# Altium project ESP32_Seperate.PrjPcb
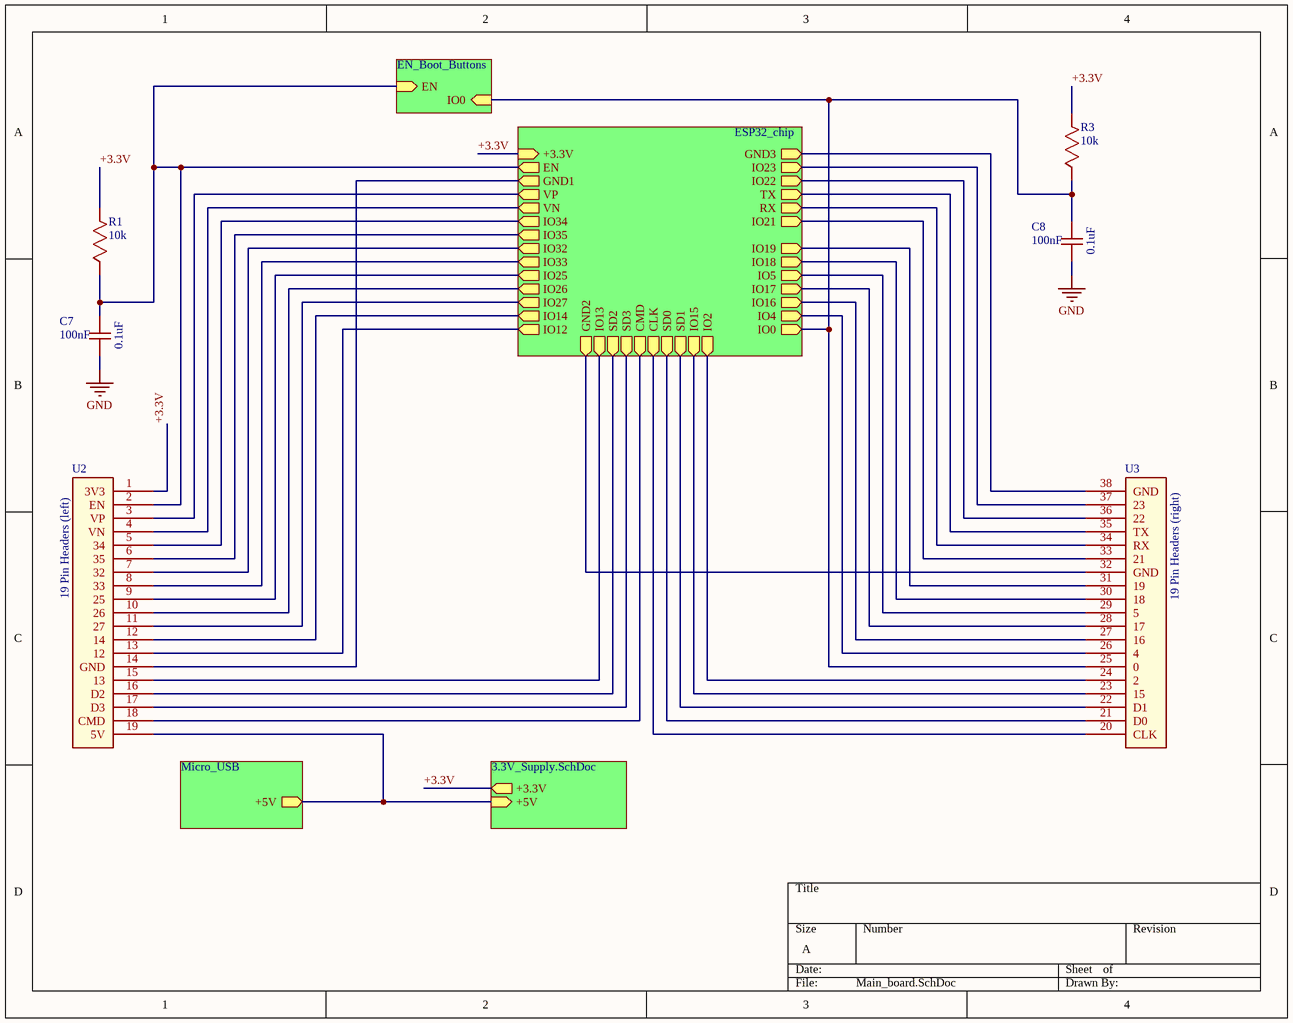
[diagram p0: Main_board.SchDoc]
5 sheets, 19 parts. Net scope: hierarchical (ports join the sheet entries above them; power ports are global).
Board file: ESP32_Seperate.PcbDoc
Sheets:
  Main_board.SchDoc
    ESP32 = ESP32_chip.SchDoc
    Buttons = EN_Boot_Buttons.SchDoc
    Connector = Micro_USB.SchDoc
    Designator = 3.3V_Supply.SchDoc

## Sheet Main_board.SchDoc
size A; SheetNumber: 1; SheetTotal: 5

### Parts
C7  100nF  [CAPC2013X140X45ML15T25]
C8  100nF  [CAPC2013X140X45ML15T25]
R1  10k  [FP-CRGCQ0805-IPC_A]
R3  10k  [FP-CRGCQ0805-IPC_A]
U2  19 Pin Headers (left)  [19 Pin headers]
U3  19 Pin Headers (right)  [19 Pin headers]

### Sub-sheets
Buttons = EN_Boot_Buttons: EN (in), IO0 (in)
Connector = Micro_USB: +5V (out)
Designator = 3.3V_Supply.SchDoc: +5V (in), +3.3V (out)
ESP32 = ESP32_chip: GND1 (out), VP (out), VN (out), IO34 (out), IO35 (out), IO32 (out), IO33 (out), IO25 (out), IO26 (out), IO27 (out), IO14 (out), IO12 (out), GND3 (out), IO23 (out), IO22 (out), TX (out), RX (out), IO21 (out), IO19 (out), IO18 (out), IO5 (out), IO17 (out), IO16 (out), IO4 (out), +3.3V (in), GND2 (out), IO13 (out), SD2 (out), SD3 (out), CMD (out), CLK (out), SD0 (out), SD1 (out), IO15 (out), IO2 (out), IO0 (out), EN (out)

### Nets
GND: C7.1 C8.1
+3.3V: R1.2 R3.2 U2.1(3V3) ; sheet ESP32/+3.3V, sheet Designator/+3.3V
NetB1_2: C7.2 R1.1 U2.2(EN) ; sheet ESP32/EN, sheet Buttons/EN
NetB2_2: C8.2 R3.1 U3.25(0) ; sheet ESP32/IO0, sheet Buttons/IO0
NetC3_1: U2.19(5V) ; sheet Connector/+5V, sheet Designator/+5V
NetU1_1: U2.14(GND) ; sheet ESP32/GND1
NetU1_4: U2.3(VP) ; sheet ESP32/VP
NetU1_5: U2.4(VN) ; sheet ESP32/VN
NetU1_6: U2.5(34) ; sheet ESP32/IO34
NetU1_7: U2.6(35) ; sheet ESP32/IO35
NetU1_8: U2.7(32) ; sheet ESP32/IO32
NetU1_9: U2.8(33) ; sheet ESP32/IO33
NetU1_10: U2.9(25) ; sheet ESP32/IO25
NetU1_11: U2.10(26) ; sheet ESP32/IO26
NetU1_12: U2.11(27) ; sheet ESP32/IO27
NetU1_13: U2.12(14) ; sheet ESP32/IO14
NetU1_14: U2.13(12) ; sheet ESP32/IO12
NetU1_15: U3.32(GND) ; sheet ESP32/GND2
NetU1_16: U2.15(13) ; sheet ESP32/IO13
NetU1_17: U2.16(D2) ; sheet ESP32/SD2
NetU1_18: U2.17(D3) ; sheet ESP32/SD3
NetU1_19: U2.18(CMD) ; sheet ESP32/CMD
NetU1_20: U3.20(CLK) ; sheet ESP32/CLK
NetU1_21: U3.21(D0) ; sheet ESP32/SD0
NetU1_22: U3.22(D1) ; sheet ESP32/SD1
NetU1_23: U3.23(15) ; sheet ESP32/IO15
NetU1_24: U3.24(2) ; sheet ESP32/IO2
NetU1_26: U3.26(4) ; sheet ESP32/IO4
NetU1_27: U3.27(16) ; sheet ESP32/IO16
NetU1_28: U3.28(17) ; sheet ESP32/IO17
NetU1_29: U3.29(5) ; sheet ESP32/IO5
NetU1_30: U3.30(18) ; sheet ESP32/IO18
NetU1_31: U3.31(19) ; sheet ESP32/IO19
NetU1_32: U3.38(GND) ; sheet ESP32/GND3
NetU1_33: U3.33(21) ; sheet ESP32/IO21
NetU1_34: U3.34(RX) ; sheet ESP32/RX
NetU1_35: U3.35(TX) ; sheet ESP32/TX
NetU1_36: U3.36(22) ; sheet ESP32/IO22
NetU1_37: U3.37(23) ; sheet ESP32/IO23

### Notes on the sheet
- (in symbol GCM21BR71E104KA37L) 0.1uF

### Library data of the parts
C7 C8 = GCM21BR71E104KA37L: Ceramic Capacitor, Ceramic, 25V, 10% +Tol, 10% -Tol, X7R, 15% TC, 0.1uF, Surface Mount, 0805; Manufacturer: Murata; Manufacturer Lifecycle Status: NRND; Supplier: DigiKey; Supplier Part Number: 490-14779-1-ND; Manufacturer Part Number: GCM21BR71E104KA37L; RoHS: Compliant; Category: Ceramic Capacitors; Stock: 12316; Pricing: 1=0.35, 10=0.208, 50=0.1528, 100=0.1358, 500=0.10726, 1000=0.09846 (USD); Value: 100nF; Case/Package: 0805; Case Code (Imperial): 0805; Case Code (Metric): 2012; Depth: 1.25mm; Dielectric: X7R; Dielectric Material: Ceramic; Height: 1.25mm; Length: 2mm; Lifecycle Status: NRND; Max Operating Temperature: 125°C; Min Operating Temperature: -55°C; Mounting Technology: Surface Mount; Number of Terminals: 2; Radiation Hardening: No; Ratings: AEC-Q200; REACH SVHC: Yes; Schedule B: 8532240020, 8532240020|8532240020|8532240020|8532240020|8532240020; Termination: SMD/SMT; Tolerance: 10%; Voltage Rating: 25V; Voltage Rating (DC): 25V; Width: 1.25mm; ComponentLink1URL: https://datasheet.octopart.com:443/GCM21BR71E104KA37L-Murata-datasheet-141268656.pdf?src-supplier=Geoflip; ComponentLink1Description: https://datasheet.octopart.com:443/GCM21BR71E104KA37L-Murata-datasheet-141268656.pdf?src-supplier=Geoflip; ComponentLink2URL: https://datasheet.octopart.com:443/GCM21BR71E104KA37L-Murata-datasheet-140660253.pdf?src-supplier=Ciiva; ComponentLink2Description: https://datasheet.octopart.com:443/GCM21BR71E104KA37L-Murata-datasheet-140660253.pdf?src-supplier=Ciiva; ComponentLink3URL: https://datasheet.octopart.com:443/GCM21BR71E104KA37L-Murata-datasheet-138719617.pdf?src-supplier=Ciiva; ComponentLink3Description: https://datasheet.octopart.com:443/GCM21BR71E104KA37L-Murata-datasheet-138719617.pdf?src-supplier=Ciiva; ComponentLink4URL: https://datasheet.octopart.com:443/GCM21BR71E104KA37L-Murata-datasheet-128592896.pdf?src-supplier=X-ON; ComponentLink4Description: https://datasheet.octopart.com:443/GCM21BR71E104KA37L-Murata-datasheet-128592896.pdf?src-supplier=X-ON; ComponentLink5URL: https://datasheet.octopart.com/GCM21BR71E104KA37L-Murata-datasheet-14404970.pdf; ComponentLink5Description: https://datasheet.octopart.com/GCM21BR71E104KA37L-Murata-datasheet-14404970.pdf; ComponentLink6URL: http://sigma.octopart.com:80/reach_statement/Murata-company-16.pdf?src-supplier=Compliance+Statements; ComponentLink6Description: http://sigma.octopart.com:80/reach_statement/Murata-company-16.pdf?src-supplier=Compliance+Statements
R1 R3 = CRGCQ0805J10K: Res Thick Film 0805 10K Ohm 5% 0.125W(1/8W) ±100ppm/C Pad SMD Automotive T/R; Manufacturer: TE Connectivity; Manufacturer Lifecycle Status: ACTIVE; Operating Supply Voltage: 150V; Power Dissipation: 125mW; Value: 10kΩ; Temperature Coefficient: 100ppm/°C; Supplier: DigiKey; Supplier Part Number: A130140CT-ND; Manufacturer Part Number: CRGCQ0805J10K; RoHS: Compliant; Category: Chip SMD Resistors; Stock: 448725; Pricing: 1=0.1, 10=0.031, 25=0.0232, 50=0.0188, 100=0.0153, 250=0.01204, 500=0.01016, 1000=0.00868 (USD); Ambient Temperature Range High: 70°C; China RoHS: Non-Compliant; Composition: Thick Film; Height: 550µm; Lifecycle Status: Production; Max Operating Temperature: 155°C; Min Operating Temperature: -55°C; Mounting Technology: Surface Mount; Number of Terminals: 2; Packaging: Cut Tape; Power Rating: 125mW; REACH SVHC: Yes; Schedule B: 8533210025, 8533210025|8533210025|8533210025|8533210025|8533210025, 8533210045; Tolerance: 5%; Voltage Rating: 150V; Voltage Rating (DC): 150V; Width: 1.25mm; Working Voltage: 150V; ComponentLink1URL: https://datasheet.octopart.com:443/CRGCQ0805J10K-TE-Connectivity-datasheet-114679081.pdf?src-supplier=Master+Electronics; ComponentLink1Description: https://datasheet.octopart.com:443/CRGCQ0805J10K-TE-Connectivity-datasheet-114679081.pdf?src-supplier=Master+Electronics; ComponentLink2URL: https://datasheet.octopart.com:443/2-2176342-5-TE-Connectivity---AMP-datasheet-189108688.pdf?src-supplier=Master+Electronics; ComponentLink2Description: https://datasheet.octopart.com:443/2-2176342-5-TE-Connectivity---AMP-datasheet-189108688.pdf?src-supplier=Master+Electronics; ComponentLink3URL: https://datasheet.octopart.com:443/CRGCQ0805J10K-TE-Connectivity-datasheet-179161841.pdf?src-supplier=IHS; ComponentLink3Description: https://datasheet.octopart.com:443/CRGCQ0805J10K-TE-Connectivity-datasheet-179161841.pdf?src-supplier=IHS; ComponentLink4URL: https://sigma.octopart.com:443/114702769/technical_drawing/TE-Connectivity-CRGCQ0805J10K.pdf?src-supplier=Sager+Electronics; ComponentLink4Description: https://sigma.octopart.com:443/114702769/technical_drawing/TE-Connectivity-CRGCQ0805J10K.pdf?src-supplier=Sager+Electronics

## Sheet ESP32_chip.SchDoc
size A; SheetNumber: 5; SheetTotal: 5
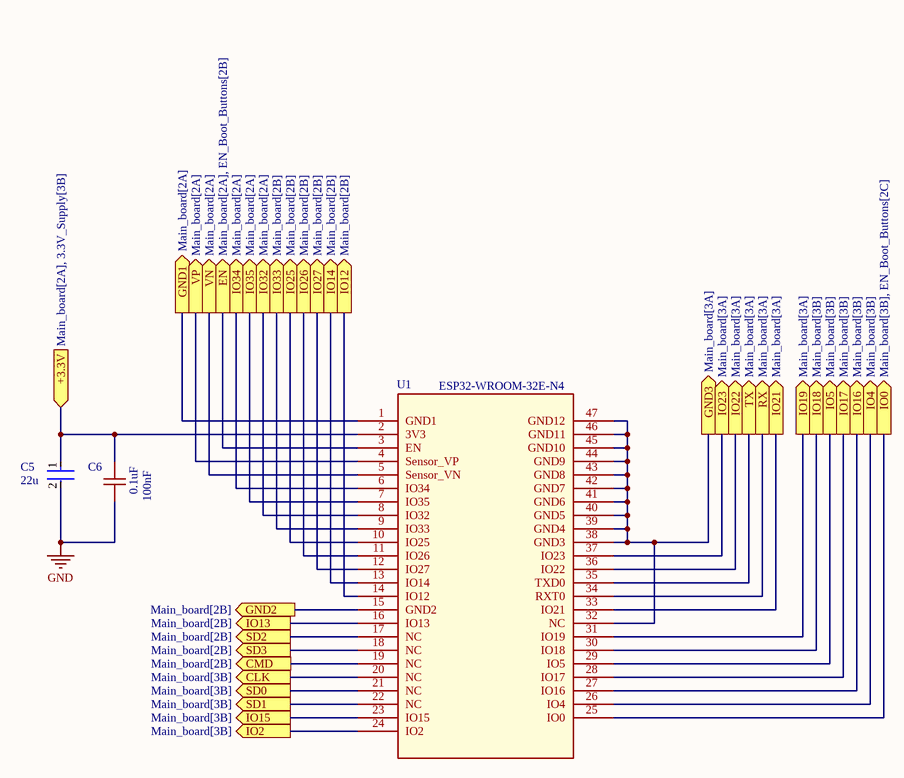
[diagram p1: ESP32_chip.SchDoc]

### Parts
C5  22u  [FP-GRM21B-0_15-IPC_A]
C6  100nF  [CAPC2013X140X45ML15T25]
U1  ESP32-WROOM-32E-N4  [ESP32­WROOM­32E_EXP]

### Ports
+3.3V (in, see Main_board[2A], 3.3V_Supply[3B]), CLK (out, see Main_board[3B]), CMD (out, see Main_board[2B]), EN (out, see Main_board[2A], EN_Boot_Buttons[2B]), GND1 (out, see Main_board[2A]), GND2 (out, see Main_board[2B]), GND3 (out, see Main_board[3A]), IO0 (out, see Main_board[3B], EN_Boot_Buttons[2C]), IO2 (out, see Main_board[3B]), IO4 (out, see Main_board[3B]), IO5 (out, see Main_board[3B]), IO12 (out, see Main_board[2B]), IO13 (out, see Main_board[2B]), IO14 (out, see Main_board[2B]), IO15 (out, see Main_board[3B]), IO16 (out, see Main_board[3B]), IO17 (out, see Main_board[3B]), IO18 (out, see Main_board[3B]), IO19 (out, see Main_board[3A]), IO21 (out, see Main_board[3A]), IO22 (out, see Main_board[3A]), IO23 (out, see Main_board[3A]), IO25 (out, see Main_board[2B]), IO26 (out, see Main_board[2B]), IO27 (out, see Main_board[2B]), IO32 (out, see Main_board[2A]), IO33 (out, see Main_board[2B]), IO34 (out, see Main_board[2A]), IO35 (out, see Main_board[2A]), RX (out, see Main_board[3A]), SD0 (out, see Main_board[3B]), SD1 (out, see Main_board[3B]), SD2 (out, see Main_board[2B]), SD3 (out, see Main_board[2B]), TX (out, see Main_board[3A]), VN (out, see Main_board[2A]), VP (out, see Main_board[2A])

### Nets
GND: C5.2 C6.1
+3.3V: C5.1 C6.2 U1.2(3V3) ; port +3.3V
NetB1_2: U1.3(EN) ; port EN
NetB2_2: U1.25(IO0) ; port IO0
NetU1_1: U1.1(GND1) ; port GND1
NetU1_4: U1.4(Sensor_VP) ; port VP
NetU1_5: U1.5(Sensor_VN) ; port VN
NetU1_6: U1.6(IO34) ; port IO34
NetU1_7: U1.7(IO35) ; port IO35
NetU1_8: U1.8(IO32) ; port IO32
NetU1_9: U1.9(IO33) ; port IO33
NetU1_10: U1.10(IO25) ; port IO25
NetU1_11: U1.11(IO26) ; port IO26
NetU1_12: U1.12(IO27) ; port IO27
NetU1_13: U1.13(IO14) ; port IO14
NetU1_14: U1.14(IO12) ; port IO12
NetU1_15: U1.15(GND2) ; port GND2
NetU1_16: U1.16(IO13) ; port IO13
NetU1_17: U1.17(NC) ; port SD2
NetU1_18: U1.18(NC) ; port SD3
NetU1_19: U1.19(NC) ; port CMD
NetU1_20: U1.20(NC) ; port CLK
NetU1_21: U1.21(NC) ; port SD0
NetU1_22: U1.22(NC) ; port SD1
NetU1_23: U1.23(IO15) ; port IO15
NetU1_24: U1.24(IO2) ; port IO2
NetU1_26: U1.26(IO4) ; port IO4
NetU1_27: U1.27(IO16) ; port IO16
NetU1_28: U1.28(IO17) ; port IO17
NetU1_29: U1.29(IO5) ; port IO5
NetU1_30: U1.30(IO18) ; port IO18
NetU1_31: U1.31(IO19) ; port IO19
NetU1_32: U1.32(NC) U1.38(GND3) U1.39(GND4) U1.40(GND5) U1.41(GND6) U1.42(GND7) U1.43(GND8) U1.44(GND9) U1.45(GND10) U1.46(GND11) U1.47(GND12) ; port GND3
NetU1_33: U1.33(IO21) ; port IO21
NetU1_34: U1.34(RXT0) ; port RX
NetU1_35: U1.35(TXD0) ; port TX
NetU1_36: U1.36(IO22) ; port IO22
NetU1_37: U1.37(IO23) ; port IO23

### Notes on the sheet
- (in symbol GCM21BR71E104KA37L) 0.1uF

### Library data of the parts
C5 = GRM21BR61A226ME51L: 0805 22 uF 10 V ±20% Tolerance X5R SMT Multilayer Ceramic Capacitor; Manufacturer: Murata; Manufacturer Lifecycle Status: IN PRODUCTION; Value: 22µF; Voltage Rating: 10V; Supplier: DigiKey; Supplier Part Number: 490-10511-1-ND; Manufacturer Part Number: GRM21BR61A226ME51L; RoHS: Compliant; Category: Ceramic Capacitors; Stock: 246273; Pricing: 1=0.19, 10=0.111, 50=0.0788, 100=0.069, 500=0.0526, 1000=0.04756 (USD); Case/Package: 0805; Case Code (Imperial): 0805; Case Code (Metric): 2012; Depth: 1.25mm; Dielectric: X5R; Dielectric Material: Ceramic; Height: 1.25mm; Lead Free: Lead Free; Length: 2mm; Lifecycle Status: Production; Material: Ceramic; Max Operating Temperature: 85°C; Min Operating Temperature: -55°C; Mounting Technology: Surface Mount; Number of Terminals: 2; Packaging: Cut Tape; Radiation Hardening: No; REACH SVHC: Yes; Schedule B: 8532240020, 8532240020|8532240020, 8532240020|8532240020|8532240020, 8532240020|8532240020|8532240020|8532240020; Termination: SMD/SMT; Thickness: 1.25mm; Tolerance: 20%; Voltage Rating (DC): 10V; Weight: 9.49709mg; Width: 1.25mm; ComponentLink1URL: https://datasheet.octopart.com:443/GRM21BR61A226ME51L-Murata-datasheet-46741949.pdf?src-supplier=element14+APAC; ComponentLink1Description: https://datasheet.octopart.com:443/GRM21BR61A226ME51L-Murata-datasheet-46741949.pdf?src-supplier=element14+APAC; ComponentLink2URL: https://datasheet.octopart.com:443/GRM21BR61A226ME51L-Murata-datasheet-141278167.pdf?src-supplier=Geoflip; ComponentLink2Description: https://datasheet.octopart.com:443/GRM21BR61A226ME51L-Murata-datasheet-141278167.pdf?src-supplier=Geoflip; ComponentLink3URL: https://datasheet.octopart.com:443/GRM21BR61A226ME51L-Murata-datasheet-165579666.pdf?src-supplier=TME; ComponentLink3Description: https://datasheet.octopart.com:443/GRM21BR61A226ME51L-Murata-datasheet-165579666.pdf?src-supplier=TME; ComponentLink4URL: https://datasheet.octopart.com:443/GRM21BR61A226ME51L-Murata-datasheet-81455648.pdf?src-supplier=TME; ComponentLink4Description: https://datasheet.octopart.com:443/GRM21BR61A226ME51L-Murata-datasheet-81455648.pdf?src-supplier=TME; ComponentLink5URL: https://datasheet.octopart.com:443/GRM21BR61A226ME51L-Murata-datasheet-140707522.pdf?src-supplier=Ciiva; ComponentLink5Description: https://datasheet.octopart.com:443/GRM21BR61A226ME51L-Murata-datasheet-140707522.pdf?src-supplier=Ciiva; ComponentLink6URL: https://datasheet.octopart.com:443/GRM21BR61A226ME51L-Murata-datasheet-138744834.pdf?src-supplier=Ciiva; ComponentLink6Description: https://datasheet.octopart.com:443/GRM21BR61A226ME51L-Murata-datasheet-138744834.pdf?src-supplier=Ciiva; ComponentLink7URL: https://datasheet.octopart.com:443/GRM21BR61A226ME51L-Murata-datasheet-22122223.pdf?src-supplier=Future+Electronics; ComponentLink7Description: https://datasheet.octopart.com:443/GRM21BR61A226ME51L-Murata-datasheet-22122223.pdf?src-supplier=Future+Electronics; ComponentLink8URL: https://datasheet.octopart.com/GRM21BR61A226ME51L-Murata-datasheet-12515295.pdf; ComponentLink8Description: https://datasheet.octopart.com/GRM21BR61A226ME51L-Murata-datasheet-12515295.pdf; ComponentLink9URL: https://datasheet.octopart.com/GRM21BR61A226ME51L-Murata-datasheet-12510076.pdf; ComponentLink9Description: https://datasheet.octopart.com/GRM21BR61A226ME51L-Murata-datasheet-12510076.pdf; ComponentLink10URL: https://datasheet.octopart.com/GRM21BR61A226ME51L-Murata-datasheet-11978611.pdf; ComponentLink10Description: https://datasheet.octopart.com/GRM21BR61A226ME51L-Murata-datasheet-11978611.pdf; ComponentLink11URL: https://datasheet.octopart.com/GRM21BR61A226ME51L-Murata-datasheet-10025737.pdf; ComponentLink11Description: https://datasheet.octopart.com/GRM21BR61A226ME51L-Murata-datasheet-10025737.pdf; ComponentLink12URL: https://datasheet.octopart.com/GRM21BR61A226ME51L-Murata-datasheet-8819587.pdf; ComponentLink12Description: https://datasheet.octopart.com/GRM21BR61A226ME51L-Murata-datasheet-8819587.pdf; ComponentLink13URL: https://datasheet.octopart.com/GRM21BR61A226ME51L-Murata-datasheet-14402366.pdf; ComponentLink13Description: https://datasheet.octopart.com/GRM21BR61A226ME51L-Murata-datasheet-14402366.pdf; ComponentLink14URL: http://sigma.octopart.com:80/reach_statement/Murata-company-16.pdf?src-supplier=Compliance+Statements; ComponentLink14Description: http://sigma.octopart.com:80/reach_statement/Murata-company-16.pdf?src-supplier=Compliance+Statements
C6 = GCM21BR71E104KA37L: as C7 on sheet Main_board; Supplier: DigiKey; Supplier Part Number: 490-14779-1-ND; Manufacturer Part Number: GCM21BR71E104KA37L; RoHS: Compliant; Category: Ceramic Capacitors; Stock: 12316; Pricing: 1=0.35, 10=0.208, 50=0.1528, 100=0.1358, 500=0.10726, 1000=0.09846 (USD); Value: 100nF; Case/Package: 0805; Case Code (Imperial): 0805; Case Code (Metric): 2012; Depth: 1.25mm; Dielectric: X7R; Dielectric Material: Ceramic; Height: 1.25mm; Length: 2mm; Lifecycle Status: NRND; Max Operating Temperature: 125°C; Min Operating Temperature: -55°C; Mounting Technology: Surface Mount; Number of Terminals: 2; Radiation Hardening: No; Ratings: AEC-Q200; REACH SVHC: Yes; Schedule B: 8532240020, 8532240020|8532240020|8532240020|8532240020|8532240020; Termination: SMD/SMT; Tolerance: 10%; Voltage Rating: 25V; Voltage Rating (DC): 25V; Width: 1.25mm; ComponentLink1URL: https://datasheet.octopart.com:443/GCM21BR71E104KA37L-Murata-datasheet-141268656.pdf?src-supplier=Geoflip; ComponentLink1Description: https://datasheet.octopart.com:443/GCM21BR71E104KA37L-Murata-datasheet-141268656.pdf?src-supplier=Geoflip; ComponentLink2URL: https://datasheet.octopart.com:443/GCM21BR71E104KA37L-Murata-datasheet-140660253.pdf?src-supplier=Ciiva; ComponentLink2Description: https://datasheet.octopart.com:443/GCM21BR71E104KA37L-Murata-datasheet-140660253.pdf?src-supplier=Ciiva; ComponentLink3URL: https://datasheet.octopart.com:443/GCM21BR71E104KA37L-Murata-datasheet-138719617.pdf?src-supplier=Ciiva; ComponentLink3Description: https://datasheet.octopart.com:443/GCM21BR71E104KA37L-Murata-datasheet-138719617.pdf?src-supplier=Ciiva; ComponentLink4URL: https://datasheet.octopart.com:443/GCM21BR71E104KA37L-Murata-datasheet-128592896.pdf?src-supplier=X-ON; ComponentLink4Description: https://datasheet.octopart.com:443/GCM21BR71E104KA37L-Murata-datasheet-128592896.pdf?src-supplier=X-ON; ComponentLink5URL: https://datasheet.octopart.com/GCM21BR71E104KA37L-Murata-datasheet-14404970.pdf; ComponentLink5Description: https://datasheet.octopart.com/GCM21BR71E104KA37L-Murata-datasheet-14404970.pdf; ComponentLink6URL: http://sigma.octopart.com:80/reach_statement/Murata-company-16.pdf?src-supplier=Compliance+Statements; ComponentLink6Description: http://sigma.octopart.com:80/reach_statement/Murata-company-16.pdf?src-supplier=Compliance+Statements
U1 = ESP32-WROOM-32E-N4: WLAN+BT Module 2412MHz to 2484MHz 47-Pin SMD Module; Manufacturer: Espressif Systems; Max Supply Voltage: 3.6V; Min Supply Voltage: 3V; Operating Supply Voltage: 3.3V; Supplier: DigiKey; Supplier Part Number: 1965-ESP32-WROOM-32E-N4CT-ND; Manufacturer Part Number: ESP32-WROOM-32E-N4; RoHS: Compliant; Category: RF Transceiver Modules and Modems; Stock: 39100; Pricing: 1=4.84, 10=4.189, 25=3.9612, 100=3.649, 250=3.46184 (USD); Height - Seated (Max): 3.25mm; Length: 25.5mm; Max Operating Temperature: 85°C; Min Operating Temperature: -40°C; Number of Terminals: 38; REACH SVHC: Yes; Terminal Pitch: 1.27mm; Width: 18mm; ComponentLink1URL: https://datasheet.octopart.com:443/ESP32-WROOM-32E-N4-Espressif-Systems-datasheet-182247776.pdf?src-supplier=IHS; ComponentLink1Description: https://datasheet.octopart.com:443/ESP32-WROOM-32E-N4-Espressif-Systems-datasheet-182247776.pdf?src-supplier=IHS; ComponentLink2URL: https://datasheet.octopart.com:443/ESP32-WROOM-32E-N4-Espressif-Systems-datasheet-188867343.pdf?src-supplier=TME; ComponentLink2Description: https://datasheet.octopart.com:443/ESP32-WROOM-32E-N4-Espressif-Systems-datasheet-188867343.pdf?src-supplier=TME; ComponentLink3URL: https://datasheet.octopart.com:443/ESP32-WROOM-32E-N4-Espressif-Systems-datasheet-165560559.pdf?src-supplier=TME; ComponentLink3Description: https://datasheet.octopart.com:443/ESP32-WROOM-32E-N4-Espressif-Systems-datasheet-165560559.pdf?src-supplier=TME; ComponentLink4URL: https://datasheet.octopart.com:443/ESP32-WROOM-32E-N4-Espressif-Systems-datasheet-151884363.pdf?src-supplier=Future+Electronics; ComponentLink4Description: https://datasheet.octopart.com:443/ESP32-WROOM-32E-N4-Espressif-Systems-datasheet-151884363.pdf?src-supplier=Future+Electronics

## Sheet EN_Boot_Buttons.SchDoc
size A; SheetNumber: 3; SheetTotal: 4
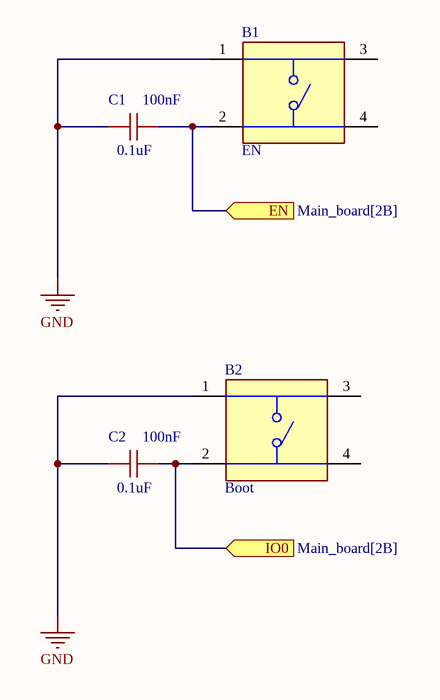
[diagram p2: EN_Boot_Buttons.SchDoc]

### Parts
B1  EN  [SW_TS04-66-43-BK-100-SMT]
B2  Boot  [SW_TS04-66-43-BK-100-SMT]
C1  100nF  [CAPC2013X140X45ML15T25]
C2  100nF  [CAPC2013X140X45ML15T25]

### Ports
EN (in, see Main_board[2B]), IO0 (in, see Main_board[2B])

### Nets
GND: B1.1 B2.1 C1.1 C2.1
NetB1_2: B1.2 C1.2 ; port EN
NetB2_2: B2.2 C2.2 ; port IO0

Not connected (* = marked no-connect by the designer): B1 3 4; B2 3 4

### Notes on the sheet
- (in symbol GCM21BR71E104KA37L) 0.1uF

### Library data of the parts
B1 B2 = TS04-66-50-BK-160-SMT-TR_1: 6 x 6 mm, 5 mm Actuator Height, 160 gf, Black, Surface Mount, SPST, Tactile Switch; Manufacturer: Same Sky; Number of Positions: 2; Supplier: DigiKey; Supplier Part Number: 2223-TS04-66-50-BK-160-SMT-TR-ND; Manufacturer Part Number: TS04-66-50-BK-160-SMT-TR; RoHS: Compliant; Category: Tactile Switches; Pricing: 5000=0.10735 (USD); Lifecycle Status: Production; REACH SVHC: Yes; ComponentLink1URL: https://datasheet.octopart.com:443/TS04-66-50-BK-160-SMT-TR-Same-Sky-datasheet-183540778.pdf?src-supplier=Same+Sky; ComponentLink1Description: https://datasheet.octopart.com:443/TS04-66-50-BK-160-SMT-TR-Same-Sky-datasheet-183540778.pdf?src-supplier=Same+Sky; ComponentLink2URL: https://datasheet.octopart.com:443/TS04-66-50-BK-160-SMT-TR-Same-Sky-datasheet-181920469.pdf?src-supplier=Same+Sky; ComponentLink2Description: https://datasheet.octopart.com:443/TS04-66-50-BK-160-SMT-TR-Same-Sky-datasheet-181920469.pdf?src-supplier=Same+Sky; ComponentLink3URL: https://datasheet.octopart.com:443/TS04-66-50-BK-160-SMT-TR-CUI-Devices-datasheet-175928975.pdf?src-supplier=Same+Sky; ComponentLink3Description: https://datasheet.octopart.com:443/TS04-66-50-BK-160-SMT-TR-CUI-Devices-datasheet-175928975.pdf?src-supplier=Same+Sky; ComponentLink4URL: https://datasheet.octopart.com:443/TS04-66-50-BK-160-SMT-TR-CUI-Devices-datasheet-155929909.pdf?src-supplier=Same+Sky; ComponentLink4Description: https://datasheet.octopart.com:443/TS04-66-50-BK-160-SMT-TR-CUI-Devices-datasheet-155929909.pdf?src-supplier=Same+Sky; ComponentLink5URL: https://datasheet.octopart.com:443/TS04-66-50-BK-160-SMT-TR-CUI-Devices-datasheet-180438940.pdf?src-supplier=IHS; ComponentLink5Description: https://datasheet.octopart.com:443/TS04-66-50-BK-160-SMT-TR-CUI-Devices-datasheet-180438940.pdf?src-supplier=IHS; ComponentLink6URL: https://datasheet.octopart.com:443/TS04-66-50-BK-160-SMT-TR-Same-Sky-datasheet-182881590.pdf?src-supplier=Master+Electronics; ComponentLink6Description: https://datasheet.octopart.com:443/TS04-66-50-BK-160-SMT-TR-Same-Sky-datasheet-182881590.pdf?src-supplier=Master+Electronics; ComponentLink7URL: https://datasheet.octopart.com:443/TS04-66-50-BK-160-SMT-TR-Same-Sky-datasheet-189105765.pdf?src-supplier=Master+Electronics; ComponentLink7Description: https://datasheet.octopart.com:443/TS04-66-50-BK-160-SMT-TR-Same-Sky-datasheet-189105765.pdf?src-supplier=Master+Electronics; ComponentLink8URL: https://datasheet.octopart.com:443/TS04-66-50-BK-160-SMT-TR-Same-Sky-datasheet-188930959.pdf?src-supplier=TME; ComponentLink8Description: https://datasheet.octopart.com:443/TS04-66-50-BK-160-SMT-TR-Same-Sky-datasheet-188930959.pdf?src-supplier=TME; ComponentLink9URL: https://octopart.com:443/opatz8j6/c1?t=AHJHVxjaiIDIr6H_ItDqsJeDJqxcW_gJHqcHV2sr14xMipfx-HDzg_f0vkasGYHy5q-Btyt4jzHIYsIXAp8M-MkPAGFwjUVKwjpKunO9EjmQ9NoVu9p4HWs04ZXCmleWgcsYh-4RxiTzSsoULU2T2rz17cMXYYLK9_ziMcA7OGPXXbacYiPMCPpI60niI4dc0C9vNkjd65Jl5QkLrYSw83J7uaIpN8OeAtGX54ooF_yVEqS3W8UGSl3Fipt3e-uZfnOteh1ynDY5inV3vA_T2G7-jmG30-JmWZ9wvWQwyL_V03hDFAcYksLWHd1aRsOPWTbxvmd88SKpkAjFm5xu5x-cK5AUD6xUpAL7lh0xeIYzTPI4ZOg&src-supplier=Compliance+Statements; ComponentLink9Description: https://octopart.com:443/opatz8j6/c1?t=AHJHVxjaiIDIr6H_ItDqsJeDJqxcW_gJHqcHV2sr14xMipfx-HDzg_f0vkasGYHy5q-Btyt4jzHIYsIXAp8M-MkPAGFwjUVKwjpKunO9EjmQ9NoVu9p4HWs04ZXCmleWgcsYh-4RxiTzSsoULU2T2rz17cMXYYLK9_ziMcA7OGPXXbacYiPMCPpI60niI4dc0C9vNkjd65Jl5QkLrYSw83J7uaIpN8OeAtGX54ooF_yVEqS3W8UGSl3Fipt3e-uZfnOteh1ynDY5inV3vA_T2G7-jmG30-JmWZ9wvWQwyL_V03hDFAcYksLWHd1aRsOPWTbxvmd88SKpkAjFm5xu5x-cK5AUD6xUpAL7lh0xeIYzTPI4ZOg&src-supplier=Compliance+Statements; ComponentLink10URL: https://octopart.com:443/opatz8j6/c1?t=r1RK5IYUaob_85_1MSHGNq720LrhxWIvMn5DWdcJs86yyX1sCCzkutHExn9MWrIEn17t5vGoIZESqBBoujGJDEtnxSOKhQoF_HVCF4IjS0uNejDB1Hl06RViT7vLEqlS2nwCB_zZjOM2FBR17Cn3AygDXFz4irEFvfs5L25X4mfGCJscXkgX4qD28LidoQEhTj1XIrzkPBX_u6sUrCtXeGFsnQuDshvHBQ8JL4sZA9KNYQB46zrK0ZjbAVBq3PHdFimw1lZsdT1205N9iIZQ-sSyoeN1xzltvm_fFJtkrMx3uypwSCqRIIazHEyIss7CzzZHpr8HJ3IPX8N9BpeGudVq5MGf4iJVtCZae_yLFL5H-ssn_Jcg6fiM&src-supplier=Compliance+Statements; ComponentLink10Description: https://octopart.com:443/opatz8j6/c1?t=r1RK5IYUaob_85_1MSHGNq720LrhxWIvMn5DWdcJs86yyX1sCCzkutHExn9MWrIEn17t5vGoIZESqBBoujGJDEtnxSOKhQoF_HVCF4IjS0uNejDB1Hl06RViT7vLEqlS2nwCB_zZjOM2FBR17Cn3AygDXFz4irEFvfs5L25X4mfGCJscXkgX4qD28LidoQEhTj1XIrzkPBX_u6sUrCtXeGFsnQuDshvHBQ8JL4sZA9KNYQB46zrK0ZjbAVBq3PHdFimw1lZsdT1205N9iIZQ-sSyoeN1xzltvm_fFJtkrMx3uypwSCqRIIazHEyIss7CzzZHpr8HJ3IPX8N9BpeGudVq5MGf4iJVtCZae_yLFL5H-ssn_Jcg6fiM&src-supplier=Compliance+Statements; ComponentLink11URL: https://octopart.com:443/opatz8j6/c1?t=3BD6yHY4TMlPV1HdH1DfP3VwhdawlDk5uvE--lE0_OK2pMAHtXMzIWognZT8Kptg4hg-lGvkc8pM6295M0wnT2xUdro5X27lLiJF0vFSPDXW_Zl-47ruo4eQI3juyTTFsaQzGMRqd6HKVavC7jLqvg3e4wdyFRwHDNXvJFlQdNWuFbKytLsG4A2-4ydZK6E80O1irTcqN9MKGvI5XzA0YOv-CaSdIebfUu8zXvQJfIAIYzNrnKqCZgH7inlQIWZHKFLA1siN4vk2QxKmFGOy5iNd7qtG1c_EzzRGUuEk66hak1i00a4FRPnHP1sGNuLupUBDn3O7toNEWVdlsVQMt_vgglZqqjFBUsOjgP800DIecR_OMlE&src-supplier=Compliance+Statements; ComponentLink11Description: https://octopart.com:443/opatz8j6/c1?t=3BD6yHY4TMlPV1HdH1DfP3VwhdawlDk5uvE--lE0_OK2pMAHtXMzIWognZT8Kptg4hg-lGvkc8pM6295M0wnT2xUdro5X27lLiJF0vFSPDXW_Zl-47ruo4eQI3juyTTFsaQzGMRqd6HKVavC7jLqvg3e4wdyFRwHDNXvJFlQdNWuFbKytLsG4A2-4ydZK6E80O1irTcqN9MKGvI5XzA0YOv-CaSdIebfUu8zXvQJfIAIYzNrnKqCZgH7inlQIWZHKFLA1siN4vk2QxKmFGOy5iNd7qtG1c_EzzRGUuEk66hak1i00a4FRPnHP1sGNuLupUBDn3O7toNEWVdlsVQMt_vgglZqqjFBUsOjgP800DIecR_OMlE&src-supplier=Compliance+Statements; ComponentLink12URL: https://octopart.com:443/opatz8j6/c1?t=K3camy5c4Ucy_9yJ3KoVII-gY7VkFhW7P0bbZ5t4-ZUOrBjcTQp1Z0CfWV0BYFVb-fHwcr_lEptVhsKeusTQzSTvOQJoYc4MNj1Xi9Ce_YgscQjK650kyvQ9iLNiSq5mGOGzGFNePsfH6U4F6nSSG09sMoZOKXesSp3A9fEB81Ryg-V7UjN_ervOIvTSSU2pt4tfCkzqxWFsAWFQreVmjyuPQN_MUGuEn3zVyQx51WI-SEu-6b7QOUpGr0zjb-yB96bbP6EohUbR0VIhPKN-WK5D9Ild7BKF3VkdDbQsJZ5I28NoVyQVl5xozYnhRN5Qb2QQksLBhOvdnNRmi85i763lg0Pnr8-dc4-8tEY2vuhnMptderCnXY8-&src-supplier=Compliance+Statements; ComponentLink12Description: https://octopart.com:443/opatz8j6/c1?t=K3camy5c4Ucy_9yJ3KoVII-gY7VkFhW7P0bbZ5t4-ZUOrBjcTQp1Z0CfWV0BYFVb-fHwcr_lEptVhsKeusTQzSTvOQJoYc4MNj1Xi9Ce_YgscQjK650kyvQ9iLNiSq5mGOGzGFNePsfH6U4F6nSSG09sMoZOKXesSp3A9fEB81Ryg-V7UjN_ervOIvTSSU2pt4tfCkzqxWFsAWFQreVmjyuPQN_MUGuEn3zVyQx51WI-SEu-6b7QOUpGr0zjb-yB96bbP6EohUbR0VIhPKN-WK5D9Ild7BKF3VkdDbQsJZ5I28NoVyQVl5xozYnhRN5Qb2QQksLBhOvdnNRmi85i763lg0Pnr8-dc4-8tEY2vuhnMptderCnXY8-&src-supplier=Compliance+Statements
C1 C2 = GCM21BR71E104KA37L: as C7 on sheet Main_board; Supplier: DigiKey; Supplier Part Number: 490-14779-1-ND; Manufacturer Part Number: GCM21BR71E104KA37L; RoHS: Compliant; Category: Ceramic Capacitors; Stock: 12316; Pricing: 1=0.35, 10=0.208, 50=0.1528, 100=0.1358, 500=0.10726, 1000=0.09846 (USD); Value: 100nF; Case/Package: 0805; Case Code (Imperial): 0805; Case Code (Metric): 2012; Depth: 1.25mm; Dielectric: X7R; Dielectric Material: Ceramic; Height: 1.25mm; Length: 2mm; Lifecycle Status: NRND; Max Operating Temperature: 125°C; Min Operating Temperature: -55°C; Mounting Technology: Surface Mount; Number of Terminals: 2; Radiation Hardening: No; Ratings: AEC-Q200; REACH SVHC: Yes; Schedule B: 8532240020, 8532240020|8532240020|8532240020|8532240020|8532240020; Termination: SMD/SMT; Tolerance: 10%; Voltage Rating: 25V; Voltage Rating (DC): 25V; Width: 1.25mm; ComponentLink1URL: https://datasheet.octopart.com:443/GCM21BR71E104KA37L-Murata-datasheet-141268656.pdf?src-supplier=Geoflip; ComponentLink1Description: https://datasheet.octopart.com:443/GCM21BR71E104KA37L-Murata-datasheet-141268656.pdf?src-supplier=Geoflip; ComponentLink2URL: https://datasheet.octopart.com:443/GCM21BR71E104KA37L-Murata-datasheet-140660253.pdf?src-supplier=Ciiva; ComponentLink2Description: https://datasheet.octopart.com:443/GCM21BR71E104KA37L-Murata-datasheet-140660253.pdf?src-supplier=Ciiva; ComponentLink3URL: https://datasheet.octopart.com:443/GCM21BR71E104KA37L-Murata-datasheet-138719617.pdf?src-supplier=Ciiva; ComponentLink3Description: https://datasheet.octopart.com:443/GCM21BR71E104KA37L-Murata-datasheet-138719617.pdf?src-supplier=Ciiva; ComponentLink4URL: https://datasheet.octopart.com:443/GCM21BR71E104KA37L-Murata-datasheet-128592896.pdf?src-supplier=X-ON; ComponentLink4Description: https://datasheet.octopart.com:443/GCM21BR71E104KA37L-Murata-datasheet-128592896.pdf?src-supplier=X-ON; ComponentLink5URL: https://datasheet.octopart.com/GCM21BR71E104KA37L-Murata-datasheet-14404970.pdf; ComponentLink5Description: https://datasheet.octopart.com/GCM21BR71E104KA37L-Murata-datasheet-14404970.pdf; ComponentLink6URL: http://sigma.octopart.com:80/reach_statement/Murata-company-16.pdf?src-supplier=Compliance+Statements; ComponentLink6Description: http://sigma.octopart.com:80/reach_statement/Murata-company-16.pdf?src-supplier=Compliance+Statements

## Sheet Micro_USB.SchDoc
size A; SheetNumber: 4; SheetTotal: 5
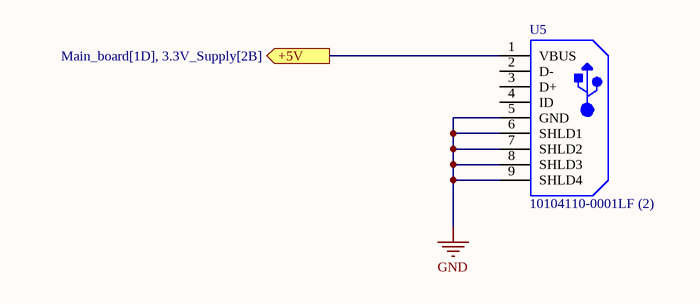
[diagram p3: Micro_USB.SchDoc]

### Parts
U5  10104110-0001LF (2)  [FCI-10104110-0001LF_V]

### Ports
+5V (out, see Main_board[1D], 3.3V_Supply[2B])

### Nets
GND: U5.5(GND) U5.6(SHLD1) U5.7(SHLD2) U5.8(SHLD3) U5.9(SHLD4)
NetC3_1: U5.1(VBUS) ; port +5V

Not connected (* = marked no-connect by the designer): U5 2(D-) 3(D+) 4(ID)

### Library data of the parts
U5 = 10104110-0001LF (2): Usb Connector, 5 Contact(S), Female, Right Angle, Surface Mount Terminal, Locking, Receptacle; Manufacturer: Amphenol Communications Solutions; Connector Type: Receptacle, USB; Contact Resistance: 10mΩ; Current Rating: 1.8A; Insulation Resistance: 100MΩ; Max Voltage Rating (AC): 100V; Number of Contacts: 5; Number of Ports: 1; Pitch: 650µm; Plating Thickness: 762nm; USB Standard: USB 2.0; Supplier: DigiKey; Supplier Part Number: 609-4052-1-ND; Manufacturer Part Number: 10104110-0001LF; RoHS: Compliant; Category: USB Connectors; Stock: 9186; Pricing: 1=0.81, 10=0.687, 25=0.6436, 50=0.613, 100=0.5836, 250=0.547, 500=0.52088 (USD); China RoHS: Compliant; Contact Gender: Female; Contact Material: Gold, Nickel; Contact Plating: Gold; Depth: 5.6mm; Gender: Receptacle; Height: 2.99mm; Housing Material: Thermoplastic; Lead Free: Lead Free; Length: 8.06mm; Lifecycle Status: Production; Max Operating Temperature: 80°C; Min Operating Temperature: -55°C; Mounting Technology: Horizontal, Surface Mount; Pins: 5; Number of Positions: 5; Number of Rows: 1; Number of Terminals: 5; Orientation: Right Angle; Radiation Hardening: No; REACH SVHC: Yes; Shell Finish: Tin; Shell Material: Stainless Steel; Terminal Pitch: 660.4µm; Termination: Solder; Voltage Rating: 100V; ComponentLink1URL: https://datasheet.octopart.com:443/10104110-0001LF-Amphenol-Communications-Solutions-datasheet-96019471.pdf?src-supplier=element14+APAC; ComponentLink1Description: https://datasheet.octopart.com:443/10104110-0001LF-Amphenol-Communications-Solutions-datasheet-96019471.pdf?src-supplier=element14+APAC; ComponentLink2URL: https://datasheet.octopart.com:443/10104110-0001LF-Amphenol-Communications-Solutions-datasheet-11971448.pdf?src-supplier=IHS; ComponentLink2Description: https://datasheet.octopart.com:443/10104110-0001LF-Amphenol-Communications-Solutions-datasheet-11971448.pdf?src-supplier=IHS; ComponentLink3URL: https://datasheet.octopart.com:443/10104110-0001LF-Amphenol-Communications-Solutions-datasheet-13707371.pdf?src-supplier=Electro+Sonic; ComponentLink3Description: https://datasheet.octopart.com:443/10104110-0001LF-Amphenol-Communications-Solutions-datasheet-13707371.pdf?src-supplier=Electro+Sonic; ComponentLink4URL: https://datasheet.octopart.com:443/10104110-0001LF-Amphenol-Communications-Solutions-datasheet-13702204.pdf?src-supplier=RS+(Formerly+Allied+Electronics); ComponentLink4Description: https://datasheet.octopart.com:443/10104110-0001LF-Amphenol-Communications-Solutions-datasheet-13702204.pdf?src-supplier=RS+(Formerly+Allied+Electronics)

## Sheet 3.3V_Supply.SchDoc
size A; SheetNumber: 2; SheetTotal: 5
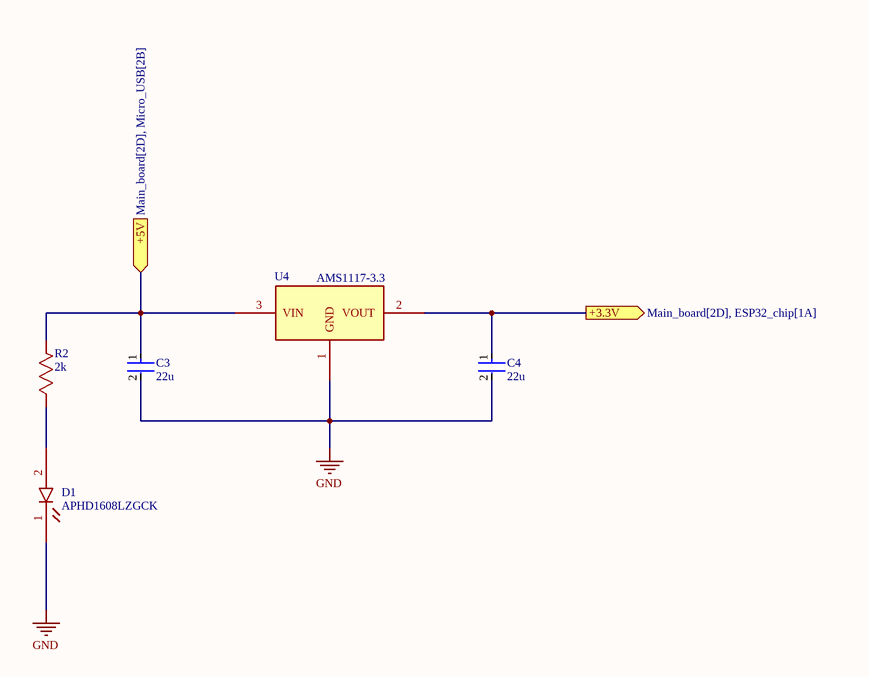
[diagram p4: 3.3V_Supply.SchDoc]

### Parts
C3  22u  [FP-GRM21B-0_15-IPC_A]
C4  22u  [FP-GRM21B-0_15-IPC_A]
D1  APHD1608LZGCK  [FP-APHD1608LZGCK-MFG]
R2  2k  [FP-CRGCQ0805-IPC_A]
U4  AMS1117-3.3  [AMS1117]

### Ports
+3.3V (out, see Main_board[2D], ESP32_chip[1A]), +5V (in, see Main_board[2D], Micro_USB[2B])

### Nets
GND: C3.2 C4.2 D1.1 U4.1(GND)
+3.3V: C4.1 U4.2(VOUT) ; port +3.3V
NetC3_1: C3.1 R2.2 U4.3(VIN) ; port +5V
NetD1_2: D1.2 R2.1

### Library data of the parts
C3 C4 = GRM21BR61A226ME51L: as C5 on sheet ESP32_chip; Supplier: DigiKey; Supplier Part Number: 490-10511-1-ND; Manufacturer Part Number: GRM21BR61A226ME51L; RoHS: Compliant; Category: Ceramic Capacitors; Stock: 246273; Pricing: 1=0.19, 10=0.111, 50=0.0788, 100=0.069, 500=0.0526, 1000=0.04756 (USD); Case/Package: 0805; Case Code (Imperial): 0805; Case Code (Metric): 2012; Depth: 1.25mm; Dielectric: X5R; Dielectric Material: Ceramic; Height: 1.25mm; Lead Free: Lead Free; Length: 2mm; Lifecycle Status: Production; Material: Ceramic; Max Operating Temperature: 85°C; Min Operating Temperature: -55°C; Mounting Technology: Surface Mount; Number of Terminals: 2; Packaging: Cut Tape; Radiation Hardening: No; REACH SVHC: Yes; Schedule B: 8532240020, 8532240020|8532240020, 8532240020|8532240020|8532240020, 8532240020|8532240020|8532240020|8532240020; Termination: SMD/SMT; Thickness: 1.25mm; Tolerance: 20%; Voltage Rating (DC): 10V; Weight: 9.49709mg; Width: 1.25mm; ComponentLink1URL: https://datasheet.octopart.com:443/GRM21BR61A226ME51L-Murata-datasheet-46741949.pdf?src-supplier=element14+APAC; ComponentLink1Description: https://datasheet.octopart.com:443/GRM21BR61A226ME51L-Murata-datasheet-46741949.pdf?src-supplier=element14+APAC; ComponentLink2URL: https://datasheet.octopart.com:443/GRM21BR61A226ME51L-Murata-datasheet-141278167.pdf?src-supplier=Geoflip; ComponentLink2Description: https://datasheet.octopart.com:443/GRM21BR61A226ME51L-Murata-datasheet-141278167.pdf?src-supplier=Geoflip; ComponentLink3URL: https://datasheet.octopart.com:443/GRM21BR61A226ME51L-Murata-datasheet-165579666.pdf?src-supplier=TME; ComponentLink3Description: https://datasheet.octopart.com:443/GRM21BR61A226ME51L-Murata-datasheet-165579666.pdf?src-supplier=TME; ComponentLink4URL: https://datasheet.octopart.com:443/GRM21BR61A226ME51L-Murata-datasheet-81455648.pdf?src-supplier=TME; ComponentLink4Description: https://datasheet.octopart.com:443/GRM21BR61A226ME51L-Murata-datasheet-81455648.pdf?src-supplier=TME; ComponentLink5URL: https://datasheet.octopart.com:443/GRM21BR61A226ME51L-Murata-datasheet-140707522.pdf?src-supplier=Ciiva; ComponentLink5Description: https://datasheet.octopart.com:443/GRM21BR61A226ME51L-Murata-datasheet-140707522.pdf?src-supplier=Ciiva; ComponentLink6URL: https://datasheet.octopart.com:443/GRM21BR61A226ME51L-Murata-datasheet-138744834.pdf?src-supplier=Ciiva; ComponentLink6Description: https://datasheet.octopart.com:443/GRM21BR61A226ME51L-Murata-datasheet-138744834.pdf?src-supplier=Ciiva; ComponentLink7URL: https://datasheet.octopart.com:443/GRM21BR61A226ME51L-Murata-datasheet-22122223.pdf?src-supplier=Future+Electronics; ComponentLink7Description: https://datasheet.octopart.com:443/GRM21BR61A226ME51L-Murata-datasheet-22122223.pdf?src-supplier=Future+Electronics; ComponentLink8URL: https://datasheet.octopart.com/GRM21BR61A226ME51L-Murata-datasheet-12515295.pdf; ComponentLink8Description: https://datasheet.octopart.com/GRM21BR61A226ME51L-Murata-datasheet-12515295.pdf; ComponentLink9URL: https://datasheet.octopart.com/GRM21BR61A226ME51L-Murata-datasheet-12510076.pdf; ComponentLink9Description: https://datasheet.octopart.com/GRM21BR61A226ME51L-Murata-datasheet-12510076.pdf; ComponentLink10URL: https://datasheet.octopart.com/GRM21BR61A226ME51L-Murata-datasheet-11978611.pdf; ComponentLink10Description: https://datasheet.octopart.com/GRM21BR61A226ME51L-Murata-datasheet-11978611.pdf; ComponentLink11URL: https://datasheet.octopart.com/GRM21BR61A226ME51L-Murata-datasheet-10025737.pdf; ComponentLink11Description: https://datasheet.octopart.com/GRM21BR61A226ME51L-Murata-datasheet-10025737.pdf; ComponentLink12URL: https://datasheet.octopart.com/GRM21BR61A226ME51L-Murata-datasheet-8819587.pdf; ComponentLink12Description: https://datasheet.octopart.com/GRM21BR61A226ME51L-Murata-datasheet-8819587.pdf; ComponentLink13URL: https://datasheet.octopart.com/GRM21BR61A226ME51L-Murata-datasheet-14402366.pdf; ComponentLink13Description: https://datasheet.octopart.com/GRM21BR61A226ME51L-Murata-datasheet-14402366.pdf; ComponentLink14URL: http://sigma.octopart.com:80/reach_statement/Murata-company-16.pdf?src-supplier=Compliance+Statements; ComponentLink14Description: http://sigma.octopart.com:80/reach_statement/Murata-company-16.pdf?src-supplier=Compliance+Statements
D1 = APHD1608LZGCK: Standard LEDs; SMD 0608 Compact Dome Lens LED; 1.6x0.8 mm; Green; (Cut Reel); Manufacturer: Kingbright; Forward Current: 20mA; Forward Voltage: 3.1V; Luminous Intensity: 50mcd; Max Junction Temperature (Tj): 110°C; Number of Circuits: 1; Peak Wavelength: 515nm; Power Dissipation: 82mW; Reverse Voltage: 5V; Shape: Round; Viewing Angle: 100°; Wavelength: 525nm; Supplier: DigiKey; Supplier Part Number: 754-2036-1-ND; Manufacturer Part Number: APHD1608LZGCK; RoHS: Compliant; Category: LEDs; Stock: 12024; Pricing: 1=0.67, 10=0.462, 100=0.3353, 500=0.27854, 1000=0.2599, 2000=0.24407 (USD); Case/Package: 0603; China RoHS: Compliant; Color: Green; Height: 650µm; Lifecycle Status: Production; Max Operating Temperature: 85°C; Min Operating Temperature: -40°C; Mounting Technology: Surface Mount; Number of Terminals: 2; REACH SVHC: Yes; Schedule B: 8541402000, 8541402000|8541402000|8541402000|8541402000|8541402000; Terminal Pitch: 1.3mm; ComponentLink1URL: https://datasheet.octopart.com:443/APHD1608LZGCK-Kingbright-datasheet-180516588.pdf?src-supplier=IHS; ComponentLink1Description: https://datasheet.octopart.com:443/APHD1608LZGCK-Kingbright-datasheet-180516588.pdf?src-supplier=IHS; ComponentLink2URL: https://datasheet.octopart.com:443/APHD1608LZGCK-Kingbright-datasheet-137333011.pdf?src-supplier=Upverter; ComponentLink2Description: https://datasheet.octopart.com:443/APHD1608LZGCK-Kingbright-datasheet-137333011.pdf?src-supplier=Upverter; ComponentLink3URL: https://datasheet.octopart.com:443/APHD1608LZGCK-Kingbright-datasheet-110729783.pdf?src-supplier=RS+(Formerly+Allied+Electronics); ComponentLink3Description: https://datasheet.octopart.com:443/APHD1608LZGCK-Kingbright-datasheet-110729783.pdf?src-supplier=RS+(Formerly+Allied+Electronics)
R2 = 1623173-1: Res Thick Film 0805 2K Ohm 1% 0.125W(1/8W) ±100ppm/C Pad SMD T/R; Manufacturer: TE Connectivity; Manufacturer Lifecycle Status: ACTIVE; Max Power Dissipation: 125mW; Number of Resistors: 1; Operating Supply Voltage: 150V; Value: 2kΩ; Temperature Coefficient: 100ppm/°C; Supplier: Newark; Supplier Part Number: 1623173-1; Manufacturer Part Number: 1623173-1; RoHS: Compliant; Category: Chip SMD Resistors; Stock: 75000; Pricing: 20000=0.005 (USD); Case/Package: 0805; Case Code (Imperial): 0805; Case Code (Metric): 2012; China RoHS: Non-Compliant; Composition: Thick Film; Depth: 1.25mm; ELV: Compliant; Height: 550µm; Length: 2mm; Lifecycle Status: Production; Max Operating Temperature: 155°C; Military Standard: Not; Min Operating Temperature: -55°C; Mounting Technology: Surface Mount; Number of Terminals: 2; Number of Terminations: 2; Packaging: Tape & Reel (TR); Power Dissipation: 125mW; Power Rating: 125mW; Radiation Hardening: No; REACH SVHC: Yes; Termination: Solder; Tolerance: 1%; Voltage Rating: 150V; Width: 1.25mm; Working Voltage: 150V; ComponentLink1URL: https://datasheet.octopart.com:443/CRG0805F2K0-TE-Connectivity-datasheet-167977698.pdf?src-supplier=IHS; ComponentLink1Description: https://datasheet.octopart.com:443/CRG0805F2K0-TE-Connectivity-datasheet-167977698.pdf?src-supplier=IHS; ComponentLink2URL: https://datasheet.octopart.com:443/1623173-1-TE-Connectivity---AMP-datasheet-11120284.pdf?src-supplier=Newark; ComponentLink2Description: https://datasheet.octopart.com:443/1623173-1-TE-Connectivity---AMP-datasheet-11120284.pdf?src-supplier=Newark; ComponentLink3URL: https://datasheet.octopart.com:443/1623173-1-TE-Connectivity---AMP-datasheet-44624597.pdf?src-supplier=Newark; ComponentLink3Description: https://datasheet.octopart.com:443/1623173-1-TE-Connectivity---AMP-datasheet-44624597.pdf?src-supplier=Newark; ComponentLink4URL: https://datasheet.octopart.com:443/1623173-1-TE-Connectivity---AMP-datasheet-128558484.pdf?src-supplier=Master+Electronics; ComponentLink4Description: https://datasheet.octopart.com:443/1623173-1-TE-Connectivity---AMP-datasheet-128558484.pdf?src-supplier=Master+Electronics; ComponentLink5URL: https://datasheet.octopart.com:443/1623173-1-TE-Connectivity---AMP-datasheet-189108518.pdf?src-supplier=Master+Electronics; ComponentLink5Description: https://datasheet.octopart.com:443/1623173-1-TE-Connectivity---AMP-datasheet-189108518.pdf?src-supplier=Master+Electronics; ComponentLink6URL: https://datasheet.octopart.com:443/1623173-1-TE-Connectivity-datasheet-14528760.pdf?src-supplier=TE+Connectivity; ComponentLink6Description: https://datasheet.octopart.com:443/1623173-1-TE-Connectivity-datasheet-14528760.pdf?src-supplier=TE+Connectivity; ComponentLink7URL: https://datasheet.octopart.com:443/CRG0805F2K0-Tyco-Electronics-datasheet-11120141.pdf?src-supplier=TE+Connectivity; ComponentLink7Description: https://datasheet.octopart.com:443/CRG0805F2K0-Tyco-Electronics-datasheet-11120141.pdf?src-supplier=TE+Connectivity; ComponentLink8URL: https://datasheet.octopart.com:443/1623173-1-TE-Connectivity-datasheet-177731334.pdf?src-supplier=Burklin+Elektronik; ComponentLink8Description: https://datasheet.octopart.com:443/1623173-1-TE-Connectivity-datasheet-177731334.pdf?src-supplier=Burklin+Elektronik; ComponentLink9URL: https://datasheet.octopart.com:443/CRG0805F2K0-TE-Connectivity-datasheet-137111065.pdf?src-supplier=X-ON; ComponentLink9Description: https://datasheet.octopart.com:443/CRG0805F2K0-TE-Connectivity-datasheet-137111065.pdf?src-supplier=X-ON; ComponentLink10URL: http://sigma.octopart.com:80/14528759/rohs_certificate/TE-Connectivity-CRG0805F2K0.pdf?src-supplier=Compliance+Statements; ComponentLink10Description: http://sigma.octopart.com:80/14528759/rohs_certificate/TE-Connectivity-CRG0805F2K0.pdf?src-supplier=Compliance+Statements; ComponentLink11URL: http://sigma.octopart.com:80/38872762/materials_sheet/TE-Connectivity-CRG0805F2K0.pdf?src-supplier=Compliance+Statements; ComponentLink11Description: http://sigma.octopart.com:80/38872762/materials_sheet/TE-Connectivity-CRG0805F2K0.pdf?src-supplier=Compliance+Statements; ComponentLink12URL: http://sigma.octopart.com:80/78339156/materials_sheet/TE-Connectivity-CRG0805F2K0.pdf?src-supplier=Compliance+Statements; ComponentLink12Description: http://sigma.octopart.com:80/78339156/materials_sheet/TE-Connectivity-CRG0805F2K0.pdf?src-supplier=Compliance+Statements

## Nets that join several sheets
GND: Main_board (C7.1 C8.1), ESP32_chip (C5.2 C6.1), EN_Boot_Buttons (B1.1 B2.1 C1.1 C2.1), Micro_USB (5 pins), 3.3V_Supply (C3.2 C4.2 D1.1 U4.1)
+3.3V: Main_board (R1.2 R3.2 U2.1), ESP32_chip (C5.1 C6.2 U1.2), 3.3V_Supply (C4.1 U4.2)
NetB1_2: Main_board (C7.2 R1.1 U2.2), ESP32_chip (U1.3), EN_Boot_Buttons (B1.2 C1.2)
NetB2_2: Main_board (C8.2 R3.1 U3.25), ESP32_chip (U1.25), EN_Boot_Buttons (B2.2 C2.2)
NetC3_1: Main_board (U2.19), Micro_USB (U5.1), 3.3V_Supply (C3.1 R2.2 U4.3)
NetU1_1: Main_board (U2.14), ESP32_chip (U1.1)
NetU1_4: Main_board (U2.3), ESP32_chip (U1.4)
NetU1_5: Main_board (U2.4), ESP32_chip (U1.5)
NetU1_6: Main_board (U2.5), ESP32_chip (U1.6)
NetU1_7: Main_board (U2.6), ESP32_chip (U1.7)
NetU1_8: Main_board (U2.7), ESP32_chip (U1.8)
NetU1_9: Main_board (U2.8), ESP32_chip (U1.9)
NetU1_10: Main_board (U2.9), ESP32_chip (U1.10)
NetU1_11: Main_board (U2.10), ESP32_chip (U1.11)
NetU1_12: Main_board (U2.11), ESP32_chip (U1.12)
NetU1_13: Main_board (U2.12), ESP32_chip (U1.13)
NetU1_14: Main_board (U2.13), ESP32_chip (U1.14)
NetU1_15: Main_board (U3.32), ESP32_chip (U1.15)
NetU1_16: Main_board (U2.15), ESP32_chip (U1.16)
NetU1_17: Main_board (U2.16), ESP32_chip (U1.17)
NetU1_18: Main_board (U2.17), ESP32_chip (U1.18)
NetU1_19: Main_board (U2.18), ESP32_chip (U1.19)
NetU1_20: Main_board (U3.20), ESP32_chip (U1.20)
NetU1_21: Main_board (U3.21), ESP32_chip (U1.21)
NetU1_22: Main_board (U3.22), ESP32_chip (U1.22)
NetU1_23: Main_board (U3.23), ESP32_chip (U1.23)
NetU1_24: Main_board (U3.24), ESP32_chip (U1.24)
NetU1_26: Main_board (U3.26), ESP32_chip (U1.26)
NetU1_27: Main_board (U3.27), ESP32_chip (U1.27)
NetU1_28: Main_board (U3.28), ESP32_chip (U1.28)
NetU1_29: Main_board (U3.29), ESP32_chip (U1.29)
NetU1_30: Main_board (U3.30), ESP32_chip (U1.30)
NetU1_31: Main_board (U3.31), ESP32_chip (U1.31)
NetU1_32: Main_board (U3.38), ESP32_chip (11 pins)
NetU1_33: Main_board (U3.33), ESP32_chip (U1.33)
NetU1_34: Main_board (U3.34), ESP32_chip (U1.34)
NetU1_35: Main_board (U3.35), ESP32_chip (U1.35)
NetU1_36: Main_board (U3.36), ESP32_chip (U1.36)
NetU1_37: Main_board (U3.37), ESP32_chip (U1.37)